# Altium schematic sheet CT100-channel.SchDoc
size A; SheetNumber: 2; SheetTotal: 2
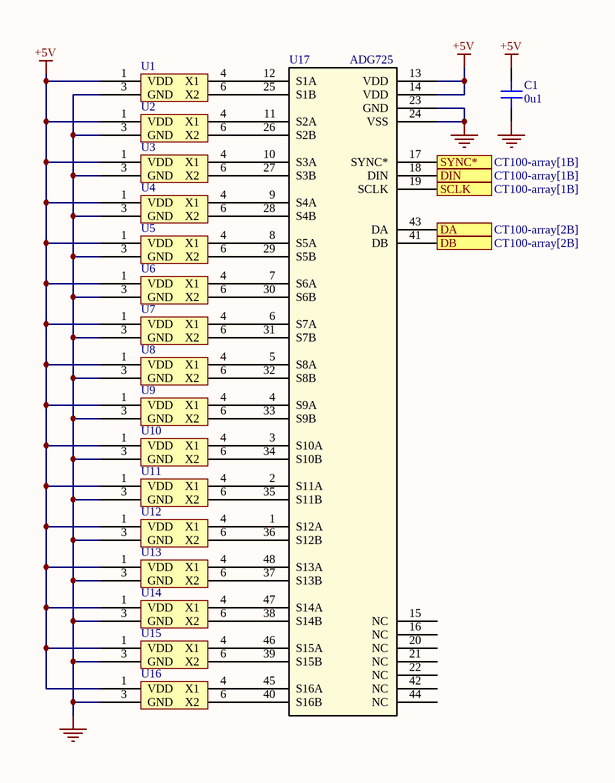
[diagram p0: CT100-channel.SchDoc]

## Parts
C1  0u1  [CAP_0402]
U1  CT100  [SON_6_CT100]  (value not drawn)
U2  CT100  [SON_6_CT100]  (value not drawn)
U3  CT100  [SON_6_CT100]  (value not drawn)
U4  CT100  [SON_6_CT100]  (value not drawn)
U5  CT100  [SON_6_CT100]  (value not drawn)
U6  CT100  [SON_6_CT100]  (value not drawn)
U7  CT100  [SON_6_CT100]  (value not drawn)
U8  CT100  [SON_6_CT100]  (value not drawn)
U9  CT100  [SON_6_CT100]  (value not drawn)
U10  CT100  [SON_6_CT100]  (value not drawn)
U11  CT100  [SON_6_CT100]  (value not drawn)
U12  CT100  [SON_6_CT100]  (value not drawn)
U13  CT100  [SON_6_CT100]  (value not drawn)
U14  CT100  [SON_6_CT100]  (value not drawn)
U15  CT100  [SON_6_CT100]  (value not drawn)
U16  CT100  [SON_6_CT100]  (value not drawn)
U17  ADG725  [SU_48_ADI]

## Ports
DA (out, see CT100-array[2B]), DB (out, see CT100-array[2B]), DIN (in, see CT100-array[1B]), SCLK (in, see CT100-array[1B]), SYNC* (in, see CT100-array[1B])

## Nets
+5V: C1.2 U1.1(VDD) U2.1(VDD) U3.1(VDD) U4.1(VDD) U5.1(VDD) U6.1(VDD) U7.1(VDD) U8.1(VDD) U9.1(VDD) U10.1(VDD) U11.1(VDD) U12.1(VDD) U13.1(VDD) U14.1(VDD) U15.1(VDD) U16.1(VDD) U17.13(VDD) U17.14(VDD)
GND: C1.1 U1.3(GND) U2.3(GND) U3.3(GND) U4.3(GND) U5.3(GND) U6.3(GND) U7.3(GND) U8.3(GND) U9.3(GND) U10.3(GND) U11.3(GND) U12.3(GND) U13.3(GND) U14.3(GND) U15.3(GND) U16.3(GND) U17.23(GND) U17.24(VSS)
DA: U17.43(DA) ; port DA
DB: U17.41(DB) ; port DB
DIN: U17.18(DIN) ; port DIN
SCLK: U17.19(SCLK) ; port SCLK
SYNC*: U17.17(SYNC*) ; port SYNC*
NetU1_4: U1.4(X1) U17.12(S1A)
NetU1_6: U1.6(X2) U17.25(S1B)
NetU2_4: U2.4(X1) U17.11(S2A)
NetU2_6: U2.6(X2) U17.26(S2B)
NetU3_4: U3.4(X1) U17.10(S3A)
NetU3_6: U3.6(X2) U17.27(S3B)
NetU4_4: U4.4(X1) U17.9(S4A)
NetU4_6: U4.6(X2) U17.28(S4B)
NetU5_4: U5.4(X1) U17.8(S5A)
NetU5_6: U5.6(X2) U17.29(S5B)
NetU6_4: U6.4(X1) U17.7(S6A)
NetU6_6: U6.6(X2) U17.30(S6B)
NetU7_4: U7.4(X1) U17.6(S7A)
NetU7_6: U7.6(X2) U17.31(S7B)
NetU8_4: U8.4(X1) U17.5(S8A)
NetU8_6: U8.6(X2) U17.32(S8B)
NetU9_4: U9.4(X1) U17.4(S9A)
NetU9_6: U9.6(X2) U17.33(S9B)
NetU10_4: U10.4(X1) U17.3(S10A)
NetU10_6: U10.6(X2) U17.34(S10B)
NetU11_4: U11.4(X1) U17.2(S11A)
NetU11_6: U11.6(X2) U17.35(S11B)
NetU12_4: U12.4(X1) U17.1(S12A)
NetU12_6: U12.6(X2) U17.36(S12B)
NetU13_4: U13.4(X1) U17.48(S13A)
NetU13_6: U13.6(X2) U17.37(S13B)
NetU14_4: U14.4(X1) U17.47(S14A)
NetU14_6: U14.6(X2) U17.38(S14B)
NetU15_4: U15.4(X1) U17.46(S15A)
NetU15_6: U15.6(X2) U17.39(S15B)
NetU16_4: U16.4(X1) U17.45(S16A)
NetU16_6: U16.6(X2) U17.40(S16B)

Not connected (* = marked no-connect by the designer): U17 15(NC) 16(NC) 20(NC) 21(NC) 22(NC) 42(NC) 44(NC)

## Library data of the parts
C1 = CAP_0402: Capacitor SMD 0402; Voltage: 50V; Capacitance: 0u1
U1-U16 = CT100LW-ID6-M: TMR Sensor, Linear, -40 to 85deg C; Manufacturer: Crocus Technology; Manufacturer Part Number: CT100LW-ID6; RoHS: Yes
U17 = ADG725BSUZ: Differential 16-Channel, Serially Controlled 3.5 Ω 1.8 V to 5.5 V, ±2.5 V, Analog Multiplexer; Mfr_Name: Analog Devices Inc; Manufacturer_Part_Number: ADG725BSUZ; RefDes: RefDes; Type: DEV